# Altium project arduino uno.PrjPcb (part 2 of 3)
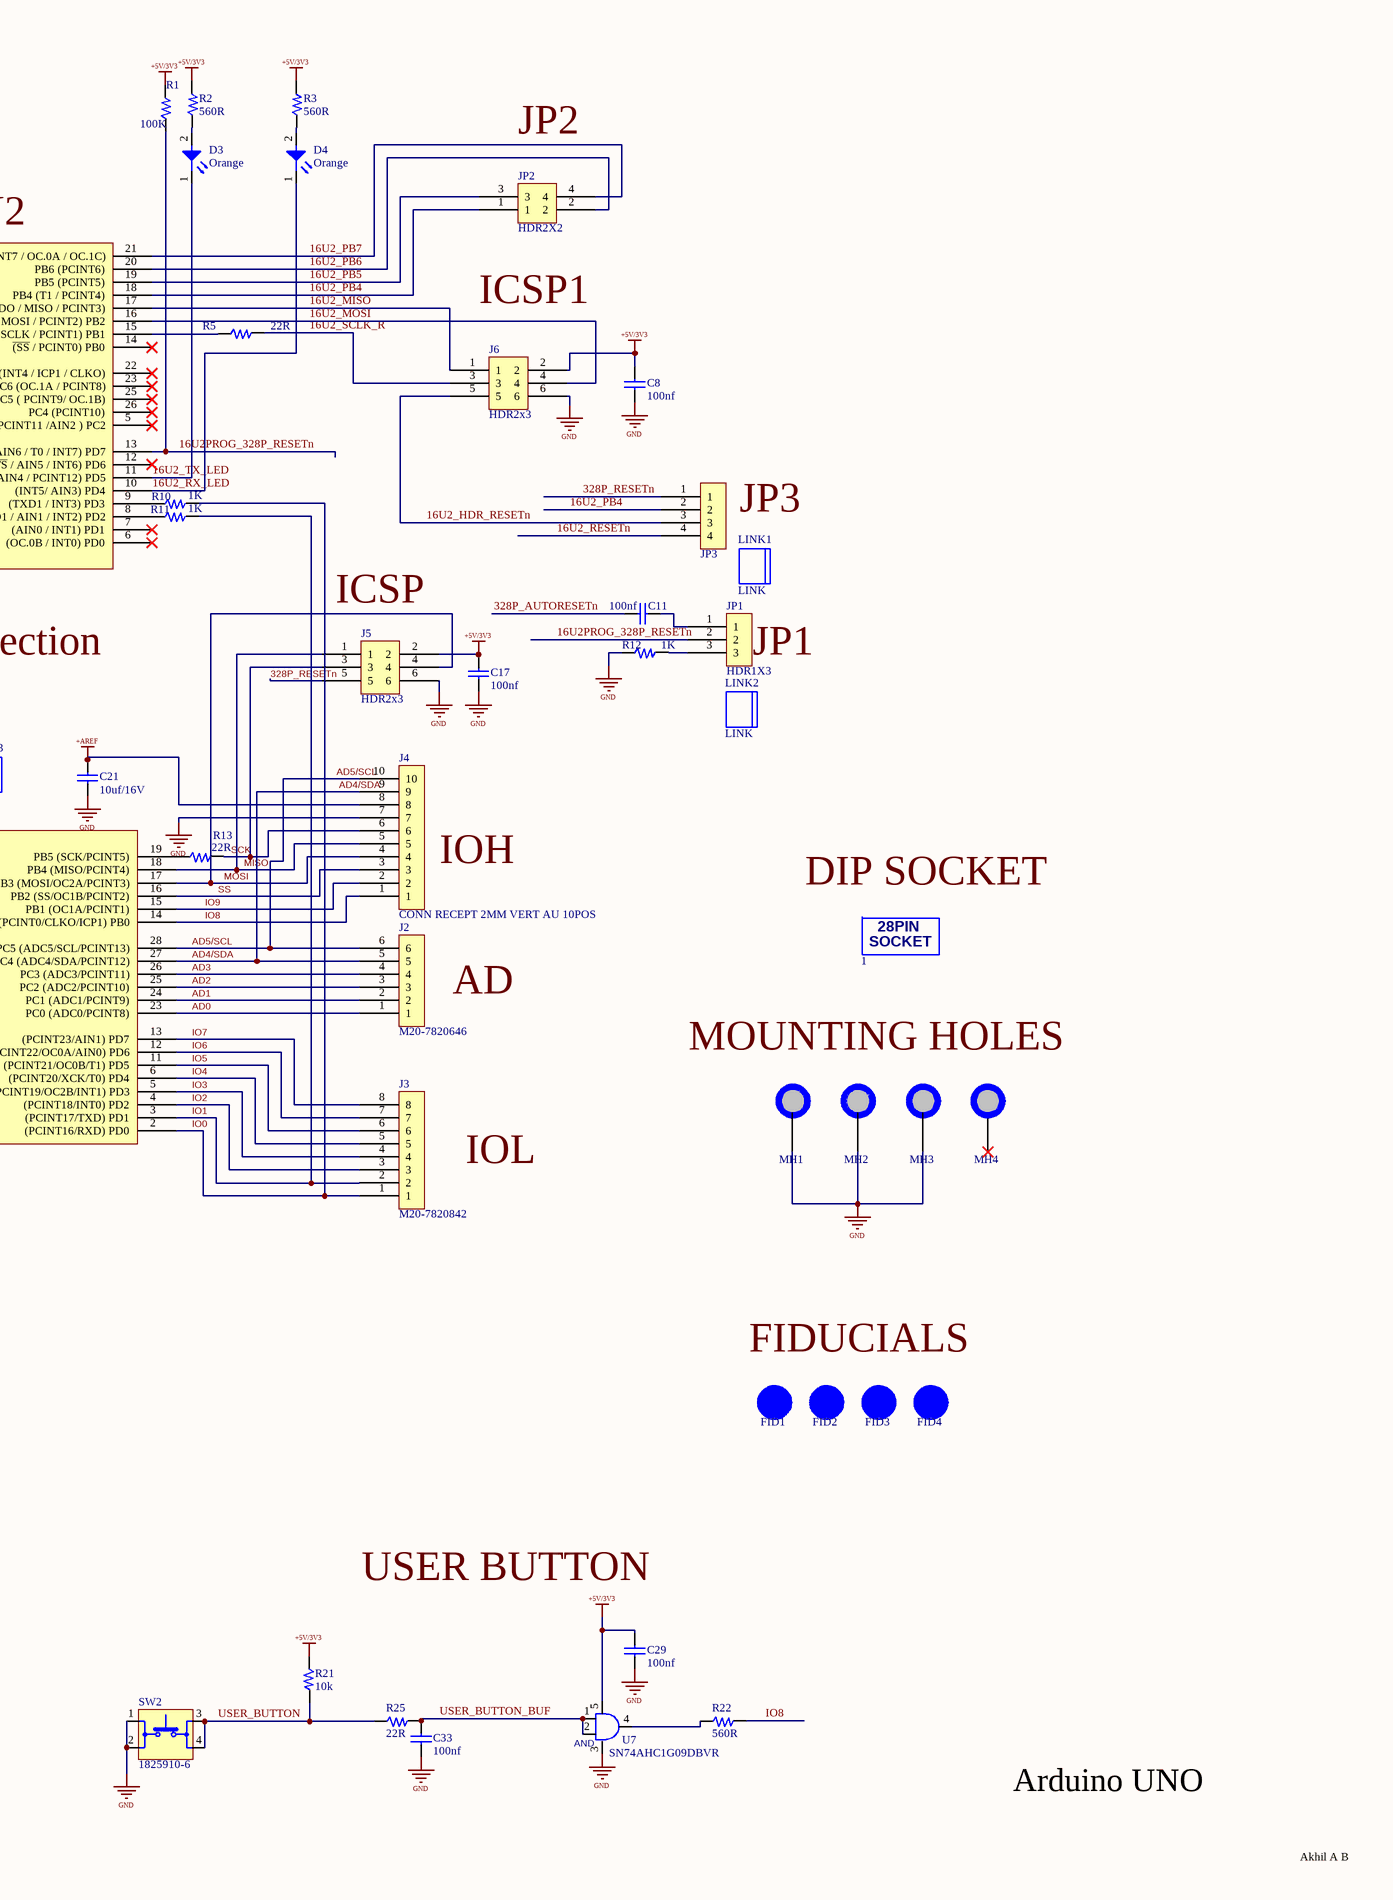
[diagram p5: arduinoUnoSchema.SchDoc, right]

## Sheet arduinoUnoSchema.SchDoc: 28pins (continued)
### Library data of the parts
1 = 4828-3004-CP: CONN IC DIP SOCKET 28POS TIN; Manufacturer: 3M; Number of Contacts: 28; Gender: Female; Insulation Resistance: 5GR; Connector Type: DIP,Socket; Current Rating: 1A; Pitch: 2.54mm; Row Spacing: 7.62mm; Supplier 1: Digi-Key; Manufacturer Part Number: 4828-3004-CP; RoHS: Yes; Category: Connectors; Stock 1: 4817; Pricing 1: 1=0.79000, 10=0.69300, 25=0.65240, 50=0.62540, 100=0.59820, 250=0.54380, 500=0.48942, 1000=0.43504, 2500=0.39426 (USD); Mount: Through Hole; Contact Material: Bronze; Contact Plating: Tin; Housing Material: Glass; Min Operating Temperature: -25°C; Max Operating Temperature: 85°C; Termination: Solder; Orientation: Straight; Number of Rows: 2; Number of Positions: 28; Package Quantity: 5600; Length: 35.43mm; Depth: 5.08mm; Width: 10.16mm; REACH SVHC: Unknown; Lead Free: Lead Free; ComponentLink1URL: https://datasheet.ciiva.com/768/ts1099-768354.pdf?src-supplier=Digi-Key; ComponentLink1Description: https://datasheet.ciiva.com/768/ts1099-768354.pdf?src-supplier=Digi-Key; Supplier Part Number 1: 3M5480-ND
*#2 = 10118193-0001LF: CONN USB MICRO B RECPT SMT R/A; Manufacturer: Amphenol FCI; Gender: Female; Number of Contacts: 5; Number of Ports: 1; Connector Type: USB,Receptacle; Current Rating: 1.8A; Insulation Resistance: 1GR; Max Voltage Rating (AC): 100V; Pitch: 0.65mm; Supplier 1: Digi-Key; Manufacturer Part Number: 10118193-0001LF; RoHS: Yes; Category: USB Connectors; Stock 1: 168000; Pricing 1: 1=0.43000, 10=0.40500, 25=0.36480, 50=0.32420, 100=0.31070, 250=0.28368, 500=0.27016 (USD); Mount: Surface Mount,Horizontal; Contact Plating: Gold; Housing Material: Polymer; Contact Material: Copper Alloy; Color: Black; Number of Terminals: 5; Min Operating Temperature: -55°C; Max Operating Temperature: 85°C; Termination: Solder; Packaging: Tape and Reel; Orientation: Right Angle; Package Quantity: 1200; Voltage Rating: 100V; Features: Shielded; Length: 7.86mm; Depth: 5.67mm; Radiation Hardening: No; Flammability Rating: UL94 V-0; ComponentLink1URL: https://datasheet.ciiva.com/26853/getdatasheetpartid-418618-26853893.pdf?src-supplier=Verical; ComponentLink1Description: https://datasheet.ciiva.com/26853/getdatasheetpartid-418618-26853893.pdf?src-supplier=Verical; ComponentLink2URL: https://datasheet.ciiva.com/851/10118193-851106.pdf?src-supplier=Digi-Key; ComponentLink2Description: https://datasheet.ciiva.com/851/10118193-851106.pdf?src-supplier=Digi-Key; ComponentLink3URL: https://datasheet.ciiva.com/14802/10118193-0001lf-webpage-14802386.pdf?src-supplier=Arrow; ComponentLink3Description: https://datasheet.ciiva.com/14802/10118193-0001lf-webpage-14802386.pdf?src-supplier=Arrow; ComponentLink4URL: https://datasheet.ciiva.com/4598/10118193ac-197151-4598799.pdf?src-supplier=Mouser; ComponentLink4Description: https://datasheet.ciiva.com/4598/10118193ac-197151-4598799.pdf?src-supplier=Mouser; ComponentLink5URL: https://datasheet.ciiva.com/14618/70236827-14618887.pdf?src-supplier=Allied+Electronics; ComponentLink5Description: https://datasheet.ciiva.com/14618/70236827-14618887.pdf?src-supplier=Allied+Electronics; ComponentLink6URL: https://datasheet.ciiva.com/851/10118193-851108.pdf?src-supplier=Digi-Key; ComponentLink6Description: https://datasheet.ciiva.com/851/10118193-851108.pdf?src-supplier=Digi-Key; ComponentLink7URL: https://datasheet.ciiva.com/851/10118193-851107.pdf?src-supplier=Digi-Key; ComponentLink7Description: https://datasheet.ciiva.com/851/10118193-851107.pdf?src-supplier=Digi-Key
C1 C2 = 100uF: Cap Aluminum 100uF 10V 20% (5 X 5.4mm) SMD 50mA 1000 hr 85°C T/R; Manufacturer: Panasonic; Manufacturer Part Number: EEE-1AA101WR; Life (Hours): 1000Hour; Supplier 1: Digi-Key; RoHS: Yes; Category: Aluminum Electrolytic Capacitors; Stock 1: 75574; Pricing 1: 1=0.32000, 10=0.22100, 100=0.13280, 500=0.09964 (USD); Mount: Surface Mount,PCB; Case/Package: Radial; Contact Plating: Tin; Min Operating Temperature: -40°C; Max Operating Temperature: 85°C; Capacitance: 100uF; Tolerance: 20%; Ripple Current: 50mA; Voltage Rating: 10V; Packaging: Tape and Reel; Package Quantity: 1; Voltage Rating (DC): 10V; Termination: SMD/SMT; Ripple Current (AC): 50mA; Diameter: 5mm; Length: 5.5mm; Height: 5.4mm; Height - Seated (Max): 0.213inch; Radiation Hardening: No; Lead Free: Lead Free; REACH SVHC: Unknown; ComponentLink1URL: https://datasheet.ciiva.com/26945/getdatasheetpartid-169213-26945071.pdf?src-supplier=Verical; ComponentLink1Description: https://datasheet.ciiva.com/26945/getdatasheetpartid-169213-26945071.pdf?src-supplier=Verical; ComponentLink2URL: https://datasheet.ciiva.com/2983/aba0000ce2-2983906.pdf?src-supplier=Avnet; ComponentLink2Description: https://datasheet.ciiva.com/2983/aba0000ce2-2983906.pdf?src-supplier=Avnet; ComponentLink3URL: https://datasheet.ciiva.com/24027/aba0000ce2-40801-24027541.pdf?src-supplier=Mouser; ComponentLink3Description: https://datasheet.ciiva.com/24027/aba0000ce2-40801-24027541.pdf?src-supplier=Mouser; ComponentLink4URL: https://datasheet.ciiva.com/30075/11aba0000ce2-30075303.pdf?src-supplier=Onlinecomponents.com; ComponentLink4Description: https://datasheet.ciiva.com/30075/11aba0000ce2-30075303.pdf?src-supplier=Onlinecomponents.com; ComponentLink5URL: https://datasheet.ciiva.com/16427/aba0000ce2-16427544.pdf?src-supplier=Future+Electronics; ComponentLink5Description: https://datasheet.ciiva.com/16427/aba0000ce2-16427544.pdf?src-supplier=Future+Electronics; ComponentLink6URL: https://datasheet.ciiva.com/14598/70255710-14598233.pdf?src-supplier=Allied+Electronics; ComponentLink6Description: https://datasheet.ciiva.com/14598/70255710-14598233.pdf?src-supplier=Allied+Electronics; ComponentLink7URL: https://datasheet.ciiva.com/14605/70255710-14605689.pdf?src-supplier=Allied+Electronics; ComponentLink7Description: https://datasheet.ciiva.com/14605/70255710-14605689.pdf?src-supplier=Allied+Electronics; ComponentLink8URL: https://datasheet.ciiva.com/11673/aba0000ce2-11673882.pdf?src-supplier=Avnet; ComponentLink8Description: https://datasheet.ciiva.com/11673/aba0000ce2-11673882.pdf?src-supplier=Avnet; Supplier Part Number 1: PCE3867CT-ND
C3 C12 C13 C19 C21 C22 C34 = 10uf/16V: TDK - C2012X5R1C106K085AC - SMD Multilayer Ceramic Capacitor, 10 µF, 16 V, 0805 [2012 Metric], ± 10%, X5R, C Series TDK; Capacitance: 10uF; Voltage Rating: 16V; Supplier 1: Digi-Key; Manufacturer: TDK; Manufacturer Part Number: C2012X5R1C106K085AC; RoHS: Yes; Category: Ceramic Capacitors; Stock 1: 1482079; Pricing 1: 1=0.25000, 10=0.17500, 100=0.09890, 500=0.06982, 1000=0.06110 (USD); Mount: Surface Mount; Case/Package: 0805; Number of Pins: 2; Weight: 0.000194oz; Case Code (Metric): 2012; Case Code (Imperial): 0805; Dielectric Material: Ceramic; Min Operating Temperature: -55°C; Max Operating Temperature: 85°C; Tolerance: 10%; Packaging: Tape and Reel; Voltage Rating (DC): 16V; Termination: SMD/SMT; Dielectric: X5R; Package Quantity: 1; Composition: Ceramic; Length: 2mm; Height: 0.85mm; Depth: 1.25mm; Width: 0.049inch; Thickness: 0.037inch; Lead Free: Lead Free; REACH SVHC: No SVHC; ComponentLink1URL: https://datasheet.ciiva.com/24218/c2012x5r1c106k085ac-264980-24218056.pdf?src-supplier=Mouser; ComponentLink1Description: https://datasheet.ciiva.com/24218/c2012x5r1c106k085ac-264980-24218056.pdf?src-supplier=Mouser; ComponentLink2URL: https://datasheet.ciiva.com/28451/1796654-28451610.pdf?src-supplier=Element14; ComponentLink2Description: https://datasheet.ciiva.com/28451/1796654-28451610.pdf?src-supplier=Element14; ComponentLink3URL: https://datasheet.ciiva.com/28602/1744655-28602170.pdf?src-supplier=Element14; ComponentLink3Description: https://datasheet.ciiva.com/28602/1744655-28602170.pdf?src-supplier=Element14; ComponentLink4URL: https://datasheet.ciiva.com/6259/tdkmlcccaprange-6259116.pdf?src-supplier=Digi-Key; ComponentLink4Description: https://datasheet.ciiva.com/6259/tdkmlcccaprange-6259116.pdf?src-supplier=Digi-Key; ComponentLink5URL: https://datasheet.ciiva.com/23803/1796654-23803020.pdf?src-supplier=Newark; ComponentLink5Description: https://datasheet.ciiva.com/23803/1796654-23803020.pdf?src-supplier=Newark; ComponentLink6URL: https://datasheet.ciiva.com/22719/1796654-22719549.pdf?src-supplier=Element14; ComponentLink6Description: https://datasheet.ciiva.com/22719/1796654-22719549.pdf?src-supplier=Element14; ComponentLink7URL: https://datasheet.ciiva.com/6259/tdkmlcccaprange-6259119.pdf?src-supplier=Digi-Key; ComponentLink7Description: https://datasheet.ciiva.com/6259/tdkmlcccaprange-6259119.pdf?src-supplier=Digi-Key; ComponentLink8URL: https://datasheet.ciiva.com/28673/mlcc-commercial-general-en-28673535.pdf?src-supplier=Element14; ComponentLink8Description: https://datasheet.ciiva.com/28673/mlcc-commercial-general-en-28673535.pdf?src-supplier=Element14; Supplier Part Number 1: 445-7644-1-ND
C4-C6 C8 C11 C14-C17 C20 C23 C24 C26 C28-C33 = 100nf0805: TDK - C2012X7R1H104K085AA - Keramikvielschichtkondensator, SMD, 0.1 µF, 50 V, 0805 [Metrisch 2012], ± 10%, X7R, C Series TDK; Dielectric Material: Ceramic; Voltage Rating: 50V; Supplier 1: Digi-Key; Manufacturer: TDK; Manufacturer Part Number: C2012X7R1H104K085AA; RoHS: Yes; Category: Ceramic Capacitors; Stock 1: 275894; Pricing 1: 1=0.17000, 10=0.11900, 100=0.05610, 500=0.03936, 1000=0.03258 (USD); Mount: Surface Mount; Case/Package: 0805; Number of Pins: 2; Weight: 0.000194oz; Case Code (Metric): 2012; Case Code (Imperial): 0805; Min Operating Temperature: -55°C; Max Operating Temperature: 125°C; Capacitance: 100nF; Tolerance: 10%; Dielectric: X7R; Termination: SMD/SMT; Packaging: Tape and Reel; Voltage Rating (DC): 50V; Composition: Ceramic; Voltage: 50V; Package Quantity: 1; Length: 2mm; Height: 0.85mm; Depth: 1.25mm; Thickness: 0.037inch; Width: 0.049inch; Radiation Hardening: No; Lead Free: Lead Free; REACH SVHC: No SVHC; ComponentLink1URL: https://datasheet.ciiva.com/11788/0900766b80c1bb00-11788128.pdf?src-supplier=RSComponents; ComponentLink1Description: https://datasheet.ciiva.com/11788/0900766b80c1bb00-11788128.pdf?src-supplier=RSComponents; ComponentLink2URL: https://datasheet.ciiva.com/6250/tdkmlcccaprange-6250821.pdf?src-supplier=Digi-Key; ComponentLink2Description: https://datasheet.ciiva.com/6250/tdkmlcccaprange-6250821.pdf?src-supplier=Digi-Key; ComponentLink3URL: https://datasheet.ciiva.com/24191/e412-c-24191447.pdf?src-supplier=Future+Electronics; ComponentLink3Description: https://datasheet.ciiva.com/24191/e412-c-24191447.pdf?src-supplier=Future+Electronics; ComponentLink4URL: https://datasheet.ciiva.com/6250/tdkmlcccaprange-6250824.pdf?src-supplier=Digi-Key; ComponentLink4Description: https://datasheet.ciiva.com/6250/tdkmlcccaprange-6250824.pdf?src-supplier=Digi-Key; ComponentLink5URL: https://datasheet.ciiva.com/23803/1796654-23803035.pdf?src-supplier=Newark; ComponentLink5Description: https://datasheet.ciiva.com/23803/1796654-23803035.pdf?src-supplier=Newark; ComponentLink6URL: https://datasheet.ciiva.com/28602/1571323-28602204.pdf?src-supplier=Element14; ComponentLink6Description: https://datasheet.ciiva.com/28602/1571323-28602204.pdf?src-supplier=Element14; Supplier Part Number 1: 445-7534-1-ND
C7 = 1uF: TDK - C2012X5R1E105K125AA - SMD Multilayer Ceramic Capacitor, 1 µF, 25 V, 0805 [2012 Metric], ± 10%, X5R, C Series; Voltage Rating: 25V; Supplier 1: Digi-Key; Manufacturer: TDK; Manufacturer Part Number: C2012X5R1E105K125AA; RoHS: Yes; Category: Ceramic Capacitors; Stock 1: 32304; Pricing 1: 1=0.27000, 10=0.18200, 100=0.09230, 500=0.06314, 1000=0.05586 (USD); Mount: Surface Mount; Case/Package: 0805; Number of Pins: 2; Weight: 0.000194oz; Case Code (Metric): 2012; Case Code (Imperial): 0805; Dielectric Material: Ceramic; Min Operating Temperature: -55°C; Max Operating Temperature: 85°C; Capacitance: 1uF; Packaging: Tape and Reel; Voltage Rating (DC): 25V; Termination: SMD/SMT; Dielectric: X5R; Tolerance: 10%; Package Quantity: 2000; Composition: Ceramic; Voltage: 25V; Length: 2mm; Height: 1.25mm; Depth: 1.25mm; Width: 0.049inch; Thickness: 0.057inch; Radiation Hardening: No; Lead Free: Lead Free; REACH SVHC: No SVHC; ComponentLink1URL: https://datasheet.ciiva.com/11787/0900766b80c1bb00-11787608.pdf?src-supplier=RSComponents; ComponentLink1Description: https://datasheet.ciiva.com/11787/0900766b80c1bb00-11787608.pdf?src-supplier=RSComponents; ComponentLink2URL: https://datasheet.ciiva.com/15192/getdatasheetpartid-726707-15192140.pdf?src-supplier=Verical; ComponentLink2Description: https://datasheet.ciiva.com/15192/getdatasheetpartid-726707-15192140.pdf?src-supplier=Verical; ComponentLink3URL: https://datasheet.ciiva.com/16449/e412-c-16449595.pdf?src-supplier=Future+Electronics; ComponentLink3Description: https://datasheet.ciiva.com/16449/e412-c-16449595.pdf?src-supplier=Future+Electronics; ComponentLink4URL: https://datasheet.ciiva.com/28602/1744655-28602171.pdf?src-supplier=Element14; ComponentLink4Description: https://datasheet.ciiva.com/28602/1744655-28602171.pdf?src-supplier=Element14; Supplier Part Number 1: 445-1419-1-ND
C9 C10 C25 C27 = C0805C180J5GACTU: CAP CER 18PF 50V C0G/NP0 0805; Manufacturer: KEMET; Dielectric Material: Ceramic; Tolerance: 5%; Dielectric: C0G; Temperature Coefficient: 30ppm/°C; Supplier 1: Digi-Key; Manufacturer Part Number: C0805C180J5GACTU; RoHS: Yes; Category: Ceramic Capacitors; Stock 1: 10088; Pricing 1: 1=0.14000, 10=0.10000, 100=0.04680, 500=0.03282, 1000=0.02716 (USD); Mount: Surface Mount; Case/Package: 0805; Contact Plating: Tin,Matte; Min Operating Temperature: -55°C; Max Operating Temperature: 125°C; Capacitance: 18pF; Packaging: Tape and Reel; Voltage: 50V; Termination: SMD/SMT; Voltage Rating (DC): 50V; Length: 2mm; Height: 0.78mm; Depth: 1.25mm; Radiation Hardening: No; Lead Free: Lead Free; ComponentLink1URL: https://datasheet.ciiva.com/22746/1769375-22746770.pdf?src-supplier=Element14; ComponentLink1Description: https://datasheet.ciiva.com/22746/1769375-22746770.pdf?src-supplier=Element14; ComponentLink2URL: https://datasheet.ciiva.com/26847/getdatasheetpartid-385668-26847862.pdf?src-supplier=Verical; ComponentLink2Description: https://datasheet.ciiva.com/26847/getdatasheetpartid-385668-26847862.pdf?src-supplier=Verical; Supplier Part Number 1: 399-1112-1-ND
D1 = LED_G: LED Uni-Color Green 572nm 2-Pin Chip 0603(1608Metric) T/R; Manufacturer: Osram Opto; Manufacturer Part Number: LGL29K-G2J1-24-Z; Lens Color: White; Forward Current: 20mA; Forward Voltage: 2.2V; Luminous Intensity: 5.6mcd; Viewing Angle: 160°; Number of LEDs: 1; Lens Style: Flat,Diffused,Colorless,Rectangular; Lens Transparency: Diffused; Reverse Voltage: 12V; Test Current: 2mA; Dominant Wavelength: 570nm; Luminous Flux: 0.012lm; Lens Size: 0.8mm; Supplier 1: Digi-Key; RoHS: Yes; Category: Uncategorized; Stock 1: 160110; Pricing 1: 1=0.42000, 10=0.30400, 100=0.19830, 500=0.14250, 1000=0.11153, 2500=0.10224 (USD); Mount: Surface Mount; Case/Package: 0603; Number of Pins: 2; Case Code (Imperial): 0603; Case Code (Metric): 1608; Color: Green; Min Operating Temperature: -40°C; Max Operating Temperature: 100°C; Illumination Color: Green; Packaging: Tape and Reel; Package Quantity: 5000; Number of Elements: 1; Length: 1.3mm; Height: 0.65mm; Width: 0.8mm; Depth: 0.8mm; Radiation Hardening: No; ComponentLink1URL: https://datasheet.ciiva.com/4689/g-l29k-39844-4689584.pdf?src-supplier=Mouser; ComponentLink1Description: https://datasheet.ciiva.com/4689/g-l29k-39844-4689584.pdf?src-supplier=Mouser; ComponentLink2URL: https://datasheet.ciiva.com/15198/getdatasheetpartid-571127-15198411.pdf?src-supplier=Verical; ComponentLink2Description: https://datasheet.ciiva.com/15198/getdatasheetpartid-571127-15198411.pdf?src-supplier=Verical; ComponentLink3URL: https://datasheet.ciiva.com/2112/00077107-0-2112886.pdf?src-supplier=Digi-Key; ComponentLink3Description: https://datasheet.ciiva.com/2112/00077107-0-2112886.pdf?src-supplier=Digi-Key; ComponentLink4URL: https://datasheet.ciiva.com/2112/00077107-0-2112887.pdf?src-supplier=Digi-Key; ComponentLink4Description: https://datasheet.ciiva.com/2112/00077107-0-2112887.pdf?src-supplier=Digi-Key; ComponentLink5URL: https://datasheet.ciiva.com/2112/00077107-0-2112888.pdf?src-supplier=Digi-Key; ComponentLink5Description: https://datasheet.ciiva.com/2112/00077107-0-2112888.pdf?src-supplier=Digi-Key; Supplier Part Number 1: 475-2709-1-ND
D2-D4 = LED_ORANGE: OSRAM - LO L29K-H2K1-24-Z - SMARTLED 0603 ORANGE; Manufacturer: Osram Opto; Lens Color: White; Forward Current: 20mA; Forward Voltage: 2.2V; Luminous Intensity: 9mcd; Viewing Angle: 160°; Test Current: 2mA; Lens Style: Flat,Diffused,Colorless,Rectangular; Dominant Wavelength: 606nm; Luminous Flux: 0.025lm; Number of Elements: 1; Reverse Voltage: 12V; Lens Transparency: Diffused; Lens Size: 0.8mm; Supplier 1: Digi-Key; Manufacturer Part Number: LOL29K-H2K1-24-Z; RoHS: Yes; Category: Uncategorized; Mount: Surface Mount; Case/Package: 0603; Number of Pins: 2; Color: Orange; Case Code (Metric): 1608; Case Code (Imperial): 0603; Min Operating Temperature: -40°C; Max Operating Temperature: 100°C; Packaging: Tape and Reel; Number of LEDs: 1; Illumination Color: Orange; Package Quantity: 5000; Length: 1.3mm; Height: 0.65mm; Depth: 0.8mm; Width: 0.8mm; Radiation Hardening: No; ComponentLink1URL: https://datasheet.ciiva.com/2112/00077105-0-2112904.pdf?src-supplier=Digi-Key; ComponentLink1Description: https://datasheet.ciiva.com/2112/00077105-0-2112904.pdf?src-supplier=Digi-Key; ComponentLink2URL: https://datasheet.ciiva.com/2112/00077105-0-2112905.pdf?src-supplier=Digi-Key; ComponentLink2Description: https://datasheet.ciiva.com/2112/00077105-0-2112905.pdf?src-supplier=Digi-Key; ComponentLink3URL: https://datasheet.ciiva.com/2112/00077105-0-2112906.pdf?src-supplier=Digi-Key; ComponentLink3Description: https://datasheet.ciiva.com/2112/00077105-0-2112906.pdf?src-supplier=Digi-Key; ComponentLink4URL: https://datasheet.ciiva.com/15198/getdatasheetpartid-693885-15198412.pdf?src-supplier=Verical; ComponentLink4Description: https://datasheet.ciiva.com/15198/getdatasheetpartid-693885-15198412.pdf?src-supplier=Verical; Supplier Part Number 1: 475-2740-2-ND
D5 D6 = BAT54HT1G: Small Signal Schottky Diode, Single, 30 V, 200 mA, 800 mV, 600 mA, 150 C ;RoHS Compliant: Yes; Manufacturer: ON Semiconductor / Fairchild; Average Rectified Current: 200mA; Reverse Recovery Time: 5ns; Max Repetitive Reverse Voltage (Vrrm): 30V; Peak Non-Repetitive Surge Current: 600mA; Forward Voltage: 800mV; Power Dissipation: 200mW; Peak Reverse Current: 2uA; Polarity: Standard; Capacitance: 10pF; Supplier 1: Digi-Key; Manufacturer Part Number: BAT54HT1G; RoHS: Yes; Category: Rectifier Diodes; Stock 1: 346918; Pricing 1: 1=0.20000, 10=0.18100, 25=0.17240, 100=0.07590, 250=0.07288, 500=0.05962, 1000=0.04140 (USD); Mount: Surface Mount; Number of Pins: 2; Contact Plating: Tin,Matte; Min Operating Temperature: -55°C; Max Operating Temperature: 150°C; Packaging: Tape and Reel; Package Quantity: 3000; Max Forward Surge Current (Ifsm): 600mA; Forward Current: 200mA; Recovery Time: 5ns; Max Reverse Voltage (DC): 30V; Element Configuration: Single; Max Surge Current: 600mA; Voltage Rating (DC): 30V; Current Rating: 200mA; Output Current: 200mA; Reverse Voltage: 30V; Max Reverse Leakage Current: 2uA; Length: 1.8mm; Height: 1mm; Width: 1.35mm; Radiation Hardening: No; Lead Free: Lead Free; REACH SVHC: No SVHC; ComponentLink1URL: https://datasheet.ciiva.com/4714/bat54ht1-d-72881-4714706.pdf?src-supplier=Mouser; ComponentLink1Description: https://datasheet.ciiva.com/4714/bat54ht1-d-72881-4714706.pdf?src-supplier=Mouser; ComponentLink2URL: https://datasheet.ciiva.com/34301/806549-34301562.pdf?src-supplier=Jameco; ComponentLink2Description: https://datasheet.ciiva.com/34301/806549-34301562.pdf?src-supplier=Jameco; ComponentLink3URL: https://datasheet.ciiva.com/4452/bat54ht1g-104602-4452889.pdf?src-supplier=Mouser; ComponentLink3Description: https://datasheet.ciiva.com/4452/bat54ht1g-104602-4452889.pdf?src-supplier=Mouser; ComponentLink4URL: https://datasheet.ciiva.com/1240/1747983-1240762.pdf?src-supplier=Newark; ComponentLink4Description: https://datasheet.ciiva.com/1240/1747983-1240762.pdf?src-supplier=Newark; ComponentLink5URL: https://datasheet.ciiva.com/30479/0900766b811a63a9-30479442.pdf?src-supplier=RSComponents; ComponentLink5Description: https://datasheet.ciiva.com/30479/0900766b811a63a9-30479442.pdf?src-supplier=RSComponents; ComponentLink6URL: https://datasheet.ciiva.com/46429/1727620-46429206.pdf?src-supplier=Element14; ComponentLink6Description: https://datasheet.ciiva.com/46429/1727620-46429206.pdf?src-supplier=Element14; ComponentLink7URL: https://datasheet.ciiva.com/8294/bat54ht1-d-8294645.pdf?src-supplier=Avnet; ComponentLink7Description: https://datasheet.ciiva.com/8294/bat54ht1-d-8294645.pdf?src-supplier=Avnet; ComponentLink8URL: https://datasheet.ciiva.com/915/bat54ht1-d-915443.pdf?src-supplier=Digi-Key; ComponentLink8Description: https://datasheet.ciiva.com/915/bat54ht1-d-915443.pdf?src-supplier=Digi-Key; ComponentLink9URL: https://datasheet.ciiva.com/910/bat54ht1g-910499.pdf?src-supplier=Digi-Key; ComponentLink9Description: https://datasheet.ciiva.com/910/bat54ht1g-910499.pdf?src-supplier=Digi-Key; ComponentLink10URL: https://datasheet.ciiva.com/910/bat54ht1g-910497.pdf?src-supplier=Digi-Key; ComponentLink10Description: https://datasheet.ciiva.com/910/bat54ht1g-910497.pdf?src-supplier=Digi-Key; ComponentLink11URL: https://datasheet.ciiva.com/17020/bat54ht1g-17020445.pdf?src-supplier=Future+Electronics; ComponentLink11Description: https://datasheet.ciiva.com/17020/bat54ht1g-17020445.pdf?src-supplier=Future+Electronics; ComponentLink12URL: https://datasheet.ciiva.com/1180/bat54ht1-d-1180251.pdf?src-supplier=Element14; ComponentLink12Description: https://datasheet.ciiva.com/1180/bat54ht1-d-1180251.pdf?src-supplier=Element14; ComponentLink13URL: https://datasheet.ciiva.com/915/bat54ht1-d-915445.pdf?src-supplier=Digi-Key; ComponentLink13Description: https://datasheet.ciiva.com/915/bat54ht1-d-915445.pdf?src-supplier=Digi-Key; ComponentLink14URL: https://datasheet.ciiva.com/915/bat54ht1-d-915444.pdf?src-supplier=Digi-Key; ComponentLink14Description: https://datasheet.ciiva.com/915/bat54ht1-d-915444.pdf?src-supplier=Digi-Key; ComponentLink15URL: https://datasheet.ciiva.com/910/bat54ht1g-910498.pdf?src-supplier=Digi-Key; ComponentLink15Description: https://datasheet.ciiva.com/910/bat54ht1g-910498.pdf?src-supplier=Digi-Key; ComponentLink16URL: https://datasheet.ciiva.com/1180/bat54ht1-d-1180252.pdf?src-supplier=Element14; ComponentLink16Description: https://datasheet.ciiva.com/1180/bat54ht1-d-1180252.pdf?src-supplier=Element14; ComponentLink17URL: https://datasheet.ciiva.com/8303/bat54ht1g-8303645.pdf?src-supplier=Avnet; ComponentLink17Description: https://datasheet.ciiva.com/8303/bat54ht1g-8303645.pdf?src-supplier=Avnet; ComponentLink18URL: https://datasheet.ciiva.com/48686/001262925-da-01-en-diode-schottky-30v-bat54ht1g-sod-323-fsc-48686266.pdf?src-supplier=Conrad; ComponentLink18Description: https://datasheet.ciiva.com/48686/001262925-da-01-en-diode-schottky-30v-bat54ht1g-sod-323-fsc-48686266.pdf?src-supplier=Conrad; Supplier Part Number 1: BAT54HT1GOSCT-ND
FB1-FB3 = MPZ2012S601AT000: FERRITE BEAD 600 OHM 0805 1LN; Manufacturer: TDK; DC Resistance (DCR): 100mR; Max DC Current: 2A; Impedance: 600R; Supplier 1: Digi-Key; Manufacturer Part Number: MPZ2012S601AT000; RoHS: Yes; Category: Inductors; Stock 1: 120052; Pricing 1: 1=0.11000, 10=0.09100, 25=0.07040, 50=0.05840, 100=0.05030, 250=0.04028, 500=0.03624, 1000=0.03020 (USD); Mount: Surface Mount; Case/Package: 0805; Case Code (Imperial): 0805; Case Code (Metric): 2012; Packaging: Tape and Reel; Package Quantity: 1; Current Rating: 2A; Length: 0.079inch; Height: 0.041inch; Width: 0.049inch; Lead Free: Lead Free; REACH SVHC: No SVHC; ComponentLink1URL: https://datasheet.ciiva.com/46634/beads-commercial-power-mpz-en-46634335.pdf?src-supplier=Digi-Key; ComponentLink1Description: https://datasheet.ciiva.com/46634/beads-commercial-power-mpz-en-46634335.pdf?src-supplier=Digi-Key; ComponentLink2URL: https://datasheet.ciiva.com/46634/beads-commercial-power-mpz-en-46634377.pdf?src-supplier=Digi-Key; ComponentLink2Description: https://datasheet.ciiva.com/46634/beads-commercial-power-mpz-en-46634377.pdf?src-supplier=Digi-Key; ComponentLink3URL: https://datasheet.ciiva.com/46634/beads-commercial-power-mpz-en-46634606.pdf?src-supplier=Digi-Key; ComponentLink3Description: https://datasheet.ciiva.com/46634/beads-commercial-power-mpz-en-46634606.pdf?src-supplier=Digi-Key; Supplier Part Number 1: 445-2206-1-ND
FID1-FID4 = FID_4X1.20: FIDUCIALS 4MMX1.20MILL MASK
j1 J3 = M20-7820842: 2.54mm (0.1") Pitch SIL Vertical PC Tail Socket Assembly, selective gold + tin, 8 contacts; Manufacturer: Harwin; Number of Contacts: 8; Connector Type: Receptacle,Socket; Gender: Female; Max Current Rating: 3A; Contact Resistance: 20mR; Supplier 1: Digi-Key; Manufacturer Part Number: M20-7820842; RoHS: Yes; Category: Headers and Wire Housings; Pricing 1: 1=1.10000, 10=0.97200, 100=0.83820, 500=0.68580, 1000=0.60960, 5000=0.53340, 10000=0.50673 (USD); Mount: Through Hole; Case/Package: SIL; Weight: 0.025397oz; Contact Plating: Tin,Gold; Housing Color: Black; Color: Black; Contact Material: Bronze; Housing Material: Polyamide; Min Operating Temperature: -40°C; Max Operating Temperature: 105°C; Termination: Solder; Number of Rows: 1; Orientation: Straight; Number of Positions: 8; Contact Gender: Female; Package Quantity: 29; Packaging: Rail/Tube; Length: 20.72mm; Pitch: 2.54mm; Depth: 2.5mm; Radiation Hardening: No; ComponentLink1URL: https://datasheet.ciiva.com/16732/m20-782-16732663.pdf?src-supplier=Avnet+Europe; ComponentLink1Description: https://datasheet.ciiva.com/16732/m20-782-16732663.pdf?src-supplier=Avnet+Europe; ComponentLink2URL: https://datasheet.ciiva.com/9480/m20-782-9480074.pdf?src-supplier=Avnet; ComponentLink2Description: https://datasheet.ciiva.com/9480/m20-782-9480074.pdf?src-supplier=Avnet; Supplier Part Number 1: 952-1823-ND
J2 = M20-7820646: 06-WAY SIL VERT SOCKET L/FREE; Manufacturer: Harwin; Number of Contacts: 6; Gender: Female; Connector Type: Receptacle,Socket; Max Current Rating: 3A; Contact Resistance: 20mR; Pitch: 2.54mm; Supplier 1: Digi-Key; Manufacturer Part Number: M20-7820646; RoHS: Yes; Category: Headers and Wire Housings; Stock 1: 1250; Pricing 1: 1=0.96000, 10=0.84200, 100=0.72600, 500=0.59400, 1000=0.52800, 5000=0.46200, 10000=0.43890 (USD); Mount: Through Hole; Case/Package: SIL; Housing Material: Nylon; Color: Black; Contact Plating: Tin; Contact Material: Bronze; Housing Color: Black; Min Operating Temperature: -40°C; Max Operating Temperature: 105°C; Termination: Solder; Number of Rows: 1; Number of Positions: 6; Packaging: Rail/Tube; Orientation: Straight; Contact Gender: Female; Package Quantity: 38; Length: 15.64mm; Depth: 2.5mm; Radiation Hardening: No; ComponentLink1URL: http://components.arrow.com/part/dataview/0323_00725884?src-supplier=Arrow+Europe; ComponentLink1Description: http://components.arrow.com/part/dataview/0323_00725884?src-supplier=Arrow+Europe; ComponentLink2URL: http://www.harwin.com/include/downloads/pdfs/2010PAGE120.PDF?src-supplier=Avnet; ComponentLink2Description: http://www.harwin.com/include/downloads/pdfs/2010PAGE120.PDF?src-supplier=Avnet; ComponentLink3URL: https://cdn.harwin.com/pdfs/M20-782.pdf?src-supplier=Digi-Key; ComponentLink3Description: https://cdn.harwin.com/pdfs/M20-782.pdf?src-supplier=Digi-Key; ComponentLink4URL: https://cdn.harwin.com/pdfs/Harwin_PC_Connectors_M20.pdf?src-supplier=Avnet+Europe; ComponentLink4Description: https://cdn.harwin.com/pdfs/Harwin_PC_Connectors_M20.pdf?src-supplier=Avnet+Europe; ComponentLink5URL: https://cdn.harwin.com/pdfs/Harwin_PC_Connectors_M20.pdf?src-supplier=RSComponents; ComponentLink5Description: https://cdn.harwin.com/pdfs/Harwin_PC_Connectors_M20.pdf?src-supplier=RSComponents; ComponentLink6URL: https://cdn.harwin.com/pdfs/Harwin_PC_Connectors_M20.pdf?src-supplier=Mouser; ComponentLink6Description: https://cdn.harwin.com/pdfs/Harwin_PC_Connectors_M20.pdf?src-supplier=Mouser; ComponentLink7URL: https://cdn.harwin.com/pdfs/Harwin_PC_Connectors_M20.pdf?src-supplier=TTI; ComponentLink7Description: https://cdn.harwin.com/pdfs/Harwin_PC_Connectors_M20.pdf?src-supplier=TTI; Supplier Part Number 1: 952-1809-ND
J4 = M22-7131042: Manufacturer: Harwin; Number of Contacts: 10; Insulation Resistance: 1GR; Connector Type: Receptacle,Socket; Max Current Rating: 1A; Max Voltage Rating (AC): 500V; Contact Resistance: 20mR; Gender: Receptacle; Supplier 1: Digi-Key; Manufacturer Part Number: M22-7131042; RoHS: Yes; Category: Headers and Wire Housings; Stock 1: 5556; Pricing 1: 1=1.49000, 10=1.34800, 100=1.15500, 500=0.96250, 1000=0.82500, 5000=0.73150, 10000=0.71500 (USD); Mount: Through Hole; Case/Package: SIL; Contact Plating: Gold; Material: Nylon; Housing Color: Black; Contact Material: Bronze; Color: Black; Housing Material: Nylon; Min Operating Temperature: -40°C; Max Operating Temperature: 105°C; Number of Rows: 1; Termination: Solder; Orientation: Straight; Packaging: Rail/Tube; Number of Positions: 10; Contact Gender: Female; Current Rating: 1A; Package Quantity: 60; Voltage Rating: 500V; Length: 20mm; Pitch: 2mm; Depth: 2.4mm; Radiation Hardening: No; Flammability Rating: UL94 V-0; REACH SVHC: No SVHC; ComponentLink1URL: https://datasheet.ciiva.com/8046/1699378-8046969.pdf?src-supplier=Element14; ComponentLink1Description: https://datasheet.ciiva.com/8046/1699378-8046969.pdf?src-supplier=Element14; ComponentLink2URL: https://datasheet.ciiva.com/11747/0900766b806cb633-11747597.pdf?src-supplier=RSComponents; ComponentLink2Description: https://datasheet.ciiva.com/11747/0900766b806cb633-11747597.pdf?src-supplier=RSComponents; ComponentLink3URL: https://datasheet.ciiva.com/411/m22-713-411142.pdf?src-supplier=Digi-Key; ComponentLink3Description: https://datasheet.ciiva.com/411/m22-713-411142.pdf?src-supplier=Digi-Key; Supplier Part Number 1: 952-1354-5-ND
J5 J6 = 67997-106HLF: CONN HEADER 6POS .100 STR 30AU; Manufacturer: Amphenol FCI; Number of Contacts: 6; Insulation Resistance: 5GR; Max Voltage Rating (AC): 1.5kV; Gender: Male; Current Rating: 3A; Connector Type: Male Pin; Pitch: 2.54mm; Row Spacing: 0.1inch; Contact Post Length: 3.05mm; Supplier 1: Digi-Key; Manufacturer Part Number: 67997-106HLF; RoHS: Yes; Category: Headers and Wire Housings; Stock 1: 1915; Pricing 1: 1=1.78000, 10=1.61400, 100=1.38370, 500=1.15308, 1000=0.98835, 5000=0.87634, 10000=0.85657 (USD); Mount: Through Hole; Contact Plating: Gold,GXT; Housing Color: Black; Contact Material: Bronze; Color: Black; Housing Material: Thermoplastic; Min Operating Temperature: -65°C; Max Operating Temperature: 125°C; Termination: Through Hole; Number of Rows: 2; Orientation: Straight; Number of Positions: 6; Packaging: Bulk; Package Quantity: 100; Contact Gender: Male; Voltage Rating: 1.5kV; Length: 7.62mm; Contact Mating Length: 0.23inch; Depth: 4.83mm; Radiation Hardening: No; Lead Free: Lead Free; REACH SVHC: No SVHC; Flammability Rating: UL94 V-0; ComponentLink1URL: https://datasheet.ciiva.com/5153/67996-222463-5153820.pdf?src-supplier=Mouser; ComponentLink1Description: https://datasheet.ciiva.com/5153/67996-222463-5153820.pdf?src-supplier=Mouser; ComponentLink2URL: https://datasheet.ciiva.com/10149/67996-10149221.pdf?src-supplier=Avnet; ComponentLink2Description: https://datasheet.ciiva.com/10149/67996-10149221.pdf?src-supplier=Avnet; ComponentLink3URL: https://datasheet.ciiva.com/46393/1876884-46393067.pdf?src-supplier=Element14; ComponentLink3Description: https://datasheet.ciiva.com/46393/1876884-46393067.pdf?src-supplier=Element14; ComponentLink4URL: https://datasheet.ciiva.com/722/67996-722044.pdf?src-supplier=Digi-Key; ComponentLink4Description: https://datasheet.ciiva.com/722/67996-722044.pdf?src-supplier=Digi-Key; ComponentLink5URL: https://datasheet.ciiva.com/16726/67996-16726286.pdf?src-supplier=Avnet+Europe; ComponentLink5Description: https://datasheet.ciiva.com/16726/67996-16726286.pdf?src-supplier=Avnet+Europe; Supplier Part Number 1: 609-3393-ND
J8 J9 = PAD_4MMX1.5MM: PAD FOR CONNECTING WIRES
JP1 JP4 = HDR1X3: Conn Unshrouded Header HDR 3 POS 2.54mm Solder ST Thru-Hole Bulk; Manufacturer: Amphenol FCI; Manufacturer Part Number: 68000-103HLF; Number of Positions: 3; Connector Type: Male Pin; Current Rating: 3A; Voltage Rating: 1.5kV; Insulation Resistance: 5GR; Gender: Male; Contact Post Length: 2.41mm; Supplier 1: Digi-Key; RoHS: Yes; Category: Headers and Wire Housings; Stock 1: 4450; Pricing 1: 1=0.29000, 10=0.27900, 100=0.19500, 500=0.16716, 1000=0.13930, 5000=0.11940, 10000=0.11144 (USD); Mount: Through Hole; Contact Plating: Gold,GXT; Contact Material: Bronze; Color: Black; Housing Color: Black; Housing Material: Thermoplastic; Min Operating Temperature: -65°C; Max Operating Temperature: 125°C; Number of Rows: 1; Termination: Through Hole; Packaging: Bulk; Number of Contacts: 3; Contact Gender: Male; Package Quantity: 100; Max Voltage Rating (AC): 1.5kV; Orientation: Straight; Length: 7.62mm; Pitch: 2.54mm; Contact Mating Length: 5.84mm; Depth: 2.41mm; Radiation Hardening: No; Flammability Rating: UL94 V-0; REACH SVHC: No SVHC; ComponentLink1URL: https://datasheet.ciiva.com/5157/68000-274283-5157301.pdf?src-supplier=Mouser; ComponentLink1Description: https://datasheet.ciiva.com/5157/68000-274283-5157301.pdf?src-supplier=Mouser; ComponentLink2URL: https://datasheet.ciiva.com/46392/1914865-46392021.pdf?src-supplier=Element14; ComponentLink2Description: https://datasheet.ciiva.com/46392/1914865-46392021.pdf?src-supplier=Element14; ComponentLink3URL: https://datasheet.ciiva.com/10149/68000-10149754.pdf?src-supplier=Avnet; ComponentLink3Description: https://datasheet.ciiva.com/10149/68000-10149754.pdf?src-supplier=Avnet; Supplier Part Number 1: 609-3461-ND
JP2 = 68602-204HLF: CONN HEADER VERT 4POS 2.54MM; Manufacturer: Amphenol FCI; Gender: Male; Connector Type: Male Pin; Number of Positions: 4; Insulation Resistance: 5GR; Current Rating: 3A; Voltage Rating: 1.5kV; Row Spacing: 0.1inch; Contact Post Length: 3.81mm; Supplier 1: Digi-Key; Manufacturer Part Number: 68602-204HLF; RoHS: Yes; Category: Headers and Wire Housings; Stock 1: 189; Pricing 1: 1=0.34000, 10=0.31900, 100=0.22320, 500=0.19132, 1000=0.15943, 5000=0.13665, 10000=0.12754 (USD); Mount: Through Hole; Housing Material: Thermoplastic; Contact Plating: Gold,GXT; Color: Black; Contact Material: Bronze; Min Operating Temperature: -65°C; Max Operating Temperature: 125°C; Termination: Solder; Packaging: Bulk; Number of Rows: 2; Number of Contacts: 4; Package Quantity: 100; Contact Gender: Male; Pitch: 2.54mm; Contact Mating Length: 0.23inch; Radiation Hardening: No; Flammability Rating: UL94 V-0; ComponentLink1URL: https://datasheet.ciiva.com/728/67996-728884.pdf?src-supplier=Digi-Key; ComponentLink1Description: https://datasheet.ciiva.com/728/67996-728884.pdf?src-supplier=Digi-Key; Supplier Part Number 1: 609-3369-ND
JP3 = 68001-204HLF: CONN HEADER VERT 4POS 2.54MM; Manufacturer: Amphenol FCI; Current Rating: 3A; Voltage Rating: 1.5kV; Connector Type: Male Pin; Gender: Male; Number of Positions: 4; Insulation Resistance: 5GR; Contact Post Length: 3.05mm; Supplier 1: Digi-Key; Manufacturer Part Number: 68001-204HLF; RoHS: Yes; Category: Headers and Wire Housings; Stock 1: 3680; Pricing 1: 1=0.38000, 10=0.35700, 100=0.25010, 500=0.21442, 1000=0.17868, 5000=0.15315, 10000=0.14294 (USD); Mount: Through Hole; Color: Black; Contact Plating: Gold,GXT; Contact Material: Bronze; Housing Material: Thermoplastic; Min Operating Temperature: -65°C; Max Operating Temperature: 125°C; Package Quantity: 100; Number of Rows: 1; Packaging: Bulk; Contact Gender: Male; Termination: Solder; Number of Contacts: 4; Orientation: Straight; Pitch: 2.54mm; Contact Mating Length: 0.23inch; Radiation Hardening: No; Flammability Rating: UL94 V-0; ComponentLink1URL: https://datasheet.ciiva.com/5164/68000-274255-5164127.pdf?src-supplier=Mouser; ComponentLink1Description: https://datasheet.ciiva.com/5164/68000-274255-5164127.pdf?src-supplier=Mouser; ComponentLink2URL: https://datasheet.ciiva.com/726/68000-726529.pdf?src-supplier=Digi-Key; ComponentLink2Description: https://datasheet.ciiva.com/726/68000-726529.pdf?src-supplier=Digi-Key; Supplier Part Number 1: 609-3402-ND
L1 = L1210R2R2MDWIT: FIXED IND 2.2UH 2A 80 MOHM SMD; Manufacturer: KEMET; Core Material: Ferrite; Tolerance: 20%; Shielding: Unshielded; Self Resonant Frequency: 190MHz; DC Resistance (DCR): 80mR; Test Frequency: 100kHz; DC Current: 1.13A; Supplier 1: Digi-Key; Manufacturer Part Number: L1210R2R2MDWIT; RoHS: Yes; Category: Fixed Inductors; Stock 1: 36610; Pricing 1: 1=0.55000, 10=0.47900, 100=0.34210, 500=0.28738 (USD); Mount: Surface Mount; Case/Package: 1210; Case Code (Metric): 3225; Case Code (Imperial): 1210; Min Operating Temperature: -40°C; Max Operating Temperature: 105°C; Inductance: 2.2uH; Max DC Current: 2A; Package Quantity: 1000; Current Rating: 2A; Packaging: Tape and Reel; Inductance Tolerance: 20%; Composition: Wirewound,Ceramic; Termination: SMD/SMT; Military Standard: Not; Length: 0.126inch; Height: 2.5mm; Width: 0.098inch; Height - Seated (Max): 0.106inch; Depth: 2.7mm; Radiation Hardening: No; REACH SVHC: No SVHC; ComponentLink1URL: https://datasheet.ciiva.com/4957/f3115-4957838.pdf?src-supplier=Mouser; ComponentLink1Description: https://datasheet.ciiva.com/4957/f3115-4957838.pdf?src-supplier=Mouser; ComponentLink2URL: https://datasheet.ciiva.com/6691/f3115-6691487.pdf?src-supplier=Digi-Key; ComponentLink2Description: https://datasheet.ciiva.com/6691/f3115-6691487.pdf?src-supplier=Digi-Key; ComponentLink3URL: https://datasheet.ciiva.com/8512/f3115-8512543.pdf?src-supplier=Avnet; ComponentLink3Description: https://datasheet.ciiva.com/8512/f3115-8512543.pdf?src-supplier=Avnet; ComponentLink4URL: https://datasheet.ciiva.com/17280/f3115-17280270.pdf?src-supplier=Avnet+Europe; ComponentLink4Description: https://datasheet.ciiva.com/17280/f3115-17280270.pdf?src-supplier=Avnet+Europe; ComponentLink5URL: https://datasheet.ciiva.com/22685/27262-22685038.pdf?src-supplier=Element14; ComponentLink5Description: https://datasheet.ciiva.com/22685/27262-22685038.pdf?src-supplier=Element14; Supplier Part Number 1: 399-9598-1-ND
LINK1-LINK3 = QPC02SXGN-RC: CONN JUMPER SHORTING .100" GOLD; Manufacturer: Sullins; Number of Positions: 2; Pitch: 0.1inch; Supplier 1: Digi-Key; Manufacturer Part Number: QPC02SXGN-RC; RoHS: Yes; Category: Connectors; Stock 1: 455162; Pricing 1: 1=0.10000, 10=0.05900, 25=0.04400, 50=0.03780, 100=0.03650, 250=0.03152, 500=0.03024, 1000=0.02646, 2500=0.02394 (USD); Case/Package: 100; Contact Plating: Gold; Package Quantity: 2000; Packaging: Bulk; Height: 0.235inch; Lead Free: Lead Free; ComponentLink1URL: https://datasheet.ciiva.com/767/284-sxgn-11510-767869.pdf?src-supplier=Digi-Key; ComponentLink1Description: https://datasheet.ciiva.com/767/284-sxgn-11510-767869.pdf?src-supplier=Digi-Key; Supplier Part Number 1: S9337-ND
MH1-MH3 = MOUNTING_HOLES_7.4MMSX3.2MMDIA: MOUNTING HOME WITH 7.2MM SIZE AND 3.2MM DRILL HOLE WITH COPPER PLATING
MH4 = MOUNTING_HOLE_7MMX3.2MM_NON_PLATED: MOUNTING HOLE 7X3.2MM NON PLATED
R1 = 100K: YAGEO         RC0805FR-07100KL            RES, THICK FILM, 100K, 1%, 0.125W, 0805, REEL; Resistance: 100kR; Temperature Coefficient: 100ppm/°C; Power Rating: 125mW; Voltage Rating (DC): 150V; Supplier 1: Digi-Key; Manufacturer: Yageo; Manufacturer Part Number: RC0805FR-07100KL; RoHS: Yes; Category: Chip SMD Resistors; Stock 1: 4860870; Pricing 1: 1=0.10000, 10=0.04000, 100=0.01630, 1000=0.00731, 2500=0.00635 (USD); Case/Package: 0805; Number of Pins: 2; Case Code (Metric): 2012; Case Code (Imperial): 0805; Min Operating Temperature: -55°C; Max Operating Temperature: 155°C; Composition: Thick Film; Tolerance: 1%; Packaging: Tape and Reel; Voltage Rating: 150V; Package Quantity: 1; Max Power Dissipation: 125mW; Number of Terminations: 2; Termination: SMD/SMT; Military Standard: Not; Features: Moisture Resistant; Length: 2mm; Height: 0.024inch; Width: 0.049inch; Depth: 1.25mm; Lead Pitch: 0.4mm; Lead Free: Lead Free; REACH SVHC: Unknown; ComponentLink1URL: https://datasheet.ciiva.com/11808/0900766b8106beab-11808858.pdf?src-supplier=RSComponents; ComponentLink1Description: https://datasheet.ciiva.com/11808/0900766b8106beab-11808858.pdf?src-supplier=RSComponents; ComponentLink2URL: https://datasheet.ciiva.com/2457/pyu-r-int-thick-7-2457017.pdf?src-supplier=Digi-Key; ComponentLink2Description: https://datasheet.ciiva.com/2457/pyu-r-int-thick-7-2457017.pdf?src-supplier=Digi-Key; ComponentLink3URL: https://datasheet.ciiva.com/12667/rc0805-12667001.pdf?src-supplier=Mouser; ComponentLink3Description: https://datasheet.ciiva.com/12667/rc0805-12667001.pdf?src-supplier=Mouser; ComponentLink4URL: https://datasheet.ciiva.com/2457/pyu-r-int-thick-7-2457018.pdf?src-supplier=Digi-Key; ComponentLink4Description: https://datasheet.ciiva.com/2457/pyu-r-int-thick-7-2457018.pdf?src-supplier=Digi-Key; ComponentLink5URL: https://datasheet.ciiva.com/16747/rc0805-16747226.pdf?src-supplier=Future+Electronics; ComponentLink5Description: https://datasheet.ciiva.com/16747/rc0805-16747226.pdf?src-supplier=Future+Electronics; ComponentLink6URL: https://datasheet.ciiva.com/2457/pyu-r-int-thick-7-2457019.pdf?src-supplier=Digi-Key; ComponentLink6Description: https://datasheet.ciiva.com/2457/pyu-r-int-thick-7-2457019.pdf?src-supplier=Digi-Key; ComponentLink7URL: https://datasheet.ciiva.com/7660/38627-7660796.pdf?src-supplier=Element14; ComponentLink7Description: https://datasheet.ciiva.com/7660/38627-7660796.pdf?src-supplier=Element14; ComponentLink8URL: https://datasheet.ciiva.com/7941/1697719-7941676.pdf?src-supplier=Element14; ComponentLink8Description: https://datasheet.ciiva.com/7941/1697719-7941676.pdf?src-supplier=Element14; ComponentLink9URL: https://datasheet.ciiva.com/7941/1686128-7941677.pdf?src-supplier=Element14; ComponentLink9Description: https://datasheet.ciiva.com/7941/1686128-7941677.pdf?src-supplier=Element14; ComponentLink10URL: https://datasheet.ciiva.com/7941/1697719-7941678.pdf?src-supplier=Element14; ComponentLink10Description: https://datasheet.ciiva.com/7941/1697719-7941678.pdf?src-supplier=Element14; ComponentLink11URL: https://datasheet.ciiva.com/22747/444164-22747534.pdf?src-supplier=Element14; ComponentLink11Description: https://datasheet.ciiva.com/22747/444164-22747534.pdf?src-supplier=Element14; Supplier Part Number 1: 311-100KCRCT-ND
R2 R3 R15 R17 R22 = 560R: Surface Mount Thick Film Resistor, RC Series, 560 ohm, 125 mW, - 1%, 150 V, 0805 [2012 Metric]; Manufacturer: Yageo; Manufacturer Part Number: RC0805FR-07560RL; Temperature Coefficient: 100ppm/°C; Power Rating: 125mW; Voltage Rating: 150V; Supplier 1: Digi-Key; RoHS: Yes; Category: Chip SMD Resistors; Stock 1: 213854; Pricing 1: 1=0.10000, 10=0.04000, 100=0.01630, 1000=0.00731, 2500=0.00635 (USD); Case/Package: 0805; Weight: 0.000194oz; Case Code (Metric): 2012; Case Code (Imperial): 0805; Min Operating Temperature: -55°C; Max Operating Temperature: 155°C; Tolerance: 1%; Resistance: 560R; Composition: Thick Film; Packaging: Tape and Reel; Max Power Dissipation: 125mW; Package Quantity: 1; Features: Moisture Resistant; Number of Terminations: 2; Termination: SMD/SMT; Military Standard: Not; Length: 2mm; Height: 0.5mm; Width: 0.049inch; Depth: 1.25mm; REACH SVHC: Unknown; Lead Free: Lead Free; ComponentLink1URL: https://datasheet.ciiva.com/2457/pyu-r-int-thick-7-2457140.pdf?src-supplier=Digi-Key; ComponentLink1Description: https://datasheet.ciiva.com/2457/pyu-r-int-thick-7-2457140.pdf?src-supplier=Digi-Key; ComponentLink2URL: https://datasheet.ciiva.com/2457/pyu-r-int-thick-7-2457141.pdf?src-supplier=Digi-Key; ComponentLink2Description: https://datasheet.ciiva.com/2457/pyu-r-int-thick-7-2457141.pdf?src-supplier=Digi-Key; ComponentLink3URL: https://datasheet.ciiva.com/5561/rc0805-5561861.pdf?src-supplier=Mouser; ComponentLink3Description: https://datasheet.ciiva.com/5561/rc0805-5561861.pdf?src-supplier=Mouser; ComponentLink4URL: https://datasheet.ciiva.com/7941/444164-7941813.pdf?src-supplier=Element14; ComponentLink4Description: https://datasheet.ciiva.com/7941/444164-7941813.pdf?src-supplier=Element14; ComponentLink5URL: https://datasheet.ciiva.com/2457/pyu-r-int-thick-7-2457142.pdf?src-supplier=Digi-Key; ComponentLink5Description: https://datasheet.ciiva.com/2457/pyu-r-int-thick-7-2457142.pdf?src-supplier=Digi-Key; ComponentLink6URL: https://datasheet.ciiva.com/7941/444164-7941814.pdf?src-supplier=Element14; ComponentLink6Description: https://datasheet.ciiva.com/7941/444164-7941814.pdf?src-supplier=Element14; Supplier Part Number 1: 311-560CRCT-ND
R4 R18-R21 = 10k: RES SMD 10K OHM 1% 1/8W 0805; Manufacturer: Yageo; Manufacturer Part Number: RC0805FR-0710KL; Temperature Coefficient: 100ppm/°C; Resistance: 10kR; Power Rating: 125mW; Voltage Rating: 150V; Supplier 1: Digi-Key; RoHS: Yes; Category: Chip SMD Resistors; Stock 1: 22608321; Pricing 1: 1=0.10000, 10=0.04000, 100=0.01630, 1000=0.00731, 2500=0.00635 (USD); Case/Package: 0805; Case Code (Imperial): 0805; Case Code (Metric): 2012; Min Operating Temperature: -55°C; Max Operating Temperature: 155°C; Composition: Thick Film; Tolerance: 1%; Packaging: Tape and Reel; Features: Moisture Resistant; Termination: SMD/SMT; Number of Terminations: 2; Military Standard: Not; Max Power Dissipation: 125mW; Package Quantity: 1; Length: 2mm; Height: 0.024inch; Width: 0.049inch; Depth: 1.25mm; Lead Free: Lead Free; REACH SVHC: Unknown; ComponentLink1URL: https://datasheet.ciiva.com/11808/0900766b8106beab-11808151.pdf?src-supplier=RSComponents; ComponentLink1Description: https://datasheet.ciiva.com/11808/0900766b8106beab-11808151.pdf?src-supplier=RSComponents; ComponentLink2URL: https://datasheet.ciiva.com/12669/rc0805-12669688.pdf?src-supplier=Mouser; ComponentLink2Description: https://datasheet.ciiva.com/12669/rc0805-12669688.pdf?src-supplier=Mouser; ComponentLink3URL: https://datasheet.ciiva.com/2456/pyu-r-int-thick-7-2456973.pdf?src-supplier=Digi-Key; ComponentLink3Description: https://datasheet.ciiva.com/2456/pyu-r-int-thick-7-2456973.pdf?src-supplier=Digi-Key; ComponentLink4URL: https://datasheet.ciiva.com/16747/rc0805-16747087.pdf?src-supplier=Future+Electronics; ComponentLink4Description: https://datasheet.ciiva.com/16747/rc0805-16747087.pdf?src-supplier=Future+Electronics; ComponentLink5URL: https://datasheet.ciiva.com/46447/444164-46447563.pdf?src-supplier=Element14; ComponentLink5Description: https://datasheet.ciiva.com/46447/444164-46447563.pdf?src-supplier=Element14; ComponentLink6URL: https://datasheet.ciiva.com/2456/pyu-r-int-thick-7-2456972.pdf?src-supplier=Digi-Key; ComponentLink6Description: https://datasheet.ciiva.com/2456/pyu-r-int-thick-7-2456972.pdf?src-supplier=Digi-Key; ComponentLink7URL: https://datasheet.ciiva.com/2456/pyu-r-int-thick-7-2456974.pdf?src-supplier=Digi-Key; ComponentLink7Description: https://datasheet.ciiva.com/2456/pyu-r-int-thick-7-2456974.pdf?src-supplier=Digi-Key; Supplier Part Number 1: 311-10.0KCRCT-ND
R5-R7 R13 R23-R25 = 22R: RES SMD 22 OHM 1% 1/8W 0805; Manufacturer: Yageo; Manufacturer Part Number: RC0805FR-0722RL; Temperature Coefficient: 100ppm/°C; Max Power Dissipation: 125mW; Working Voltage: 150V; Supplier 1: Digi-Key; RoHS: Yes; Category: Chip SMD Resistors; Pricing 1: 1=0.10000, 10=0.04000, 100=0.01630, 1000=0.00731, 2500=0.00635 (USD); Case/Package: 0805; Case Code (Metric): 2012; Case Code (Imperial): 0805; Min Operating Temperature: -55°C; Max Operating Temperature: 155°C; Composition: Thick Film; Resistance: 22R; Tolerance: 1%; Packaging: Tape and Reel; Features: Moisture Resistant; Number of Terminations: 2; Termination: SMD/SMT; Military Standard: Not; Power Rating: 125mW; Voltage Rating: 150V; Package Quantity: 1; Length: 0.079inch; Height: 0.024inch; Width: 0.049inch; Depth: 1.25mm; REACH SVHC: Unknown; Lead Free: Lead Free; ComponentLink1URL: https://datasheet.ciiva.com/11819/0900766b8106beab-11819837.pdf?src-supplier=RSComponents; ComponentLink1Description: https://datasheet.ciiva.com/11819/0900766b8106beab-11819837.pdf?src-supplier=RSComponents; ComponentLink2URL: https://datasheet.ciiva.com/2457/pyu-r-int-thick-7-2457044.pdf?src-supplier=Digi-Key; ComponentLink2Description: https://datasheet.ciiva.com/2457/pyu-r-int-thick-7-2457044.pdf?src-supplier=Digi-Key; ComponentLink3URL: https://datasheet.ciiva.com/46447/444164-46447574.pdf?src-supplier=Element14; ComponentLink3Description: https://datasheet.ciiva.com/46447/444164-46447574.pdf?src-supplier=Element14; ComponentLink4URL: https://datasheet.ciiva.com/2457/pyu-r-int-thick-7-2457045.pdf?src-supplier=Digi-Key; ComponentLink4Description: https://datasheet.ciiva.com/2457/pyu-r-int-thick-7-2457045.pdf?src-supplier=Digi-Key; ComponentLink5URL: https://datasheet.ciiva.com/2457/pyu-r-int-thick-7-2457046.pdf?src-supplier=Digi-Key; ComponentLink5Description: https://datasheet.ciiva.com/2457/pyu-r-int-thick-7-2457046.pdf?src-supplier=Digi-Key; ComponentLink6URL: https://datasheet.ciiva.com/12667/rc0805-12667371.pdf?src-supplier=Mouser; ComponentLink6Description: https://datasheet.ciiva.com/12667/rc0805-12667371.pdf?src-supplier=Mouser; Supplier Part Number 1: 311-22.0CRCT-ND